# EAGLE design Lemming2_power (EAGLE 8.0.0)
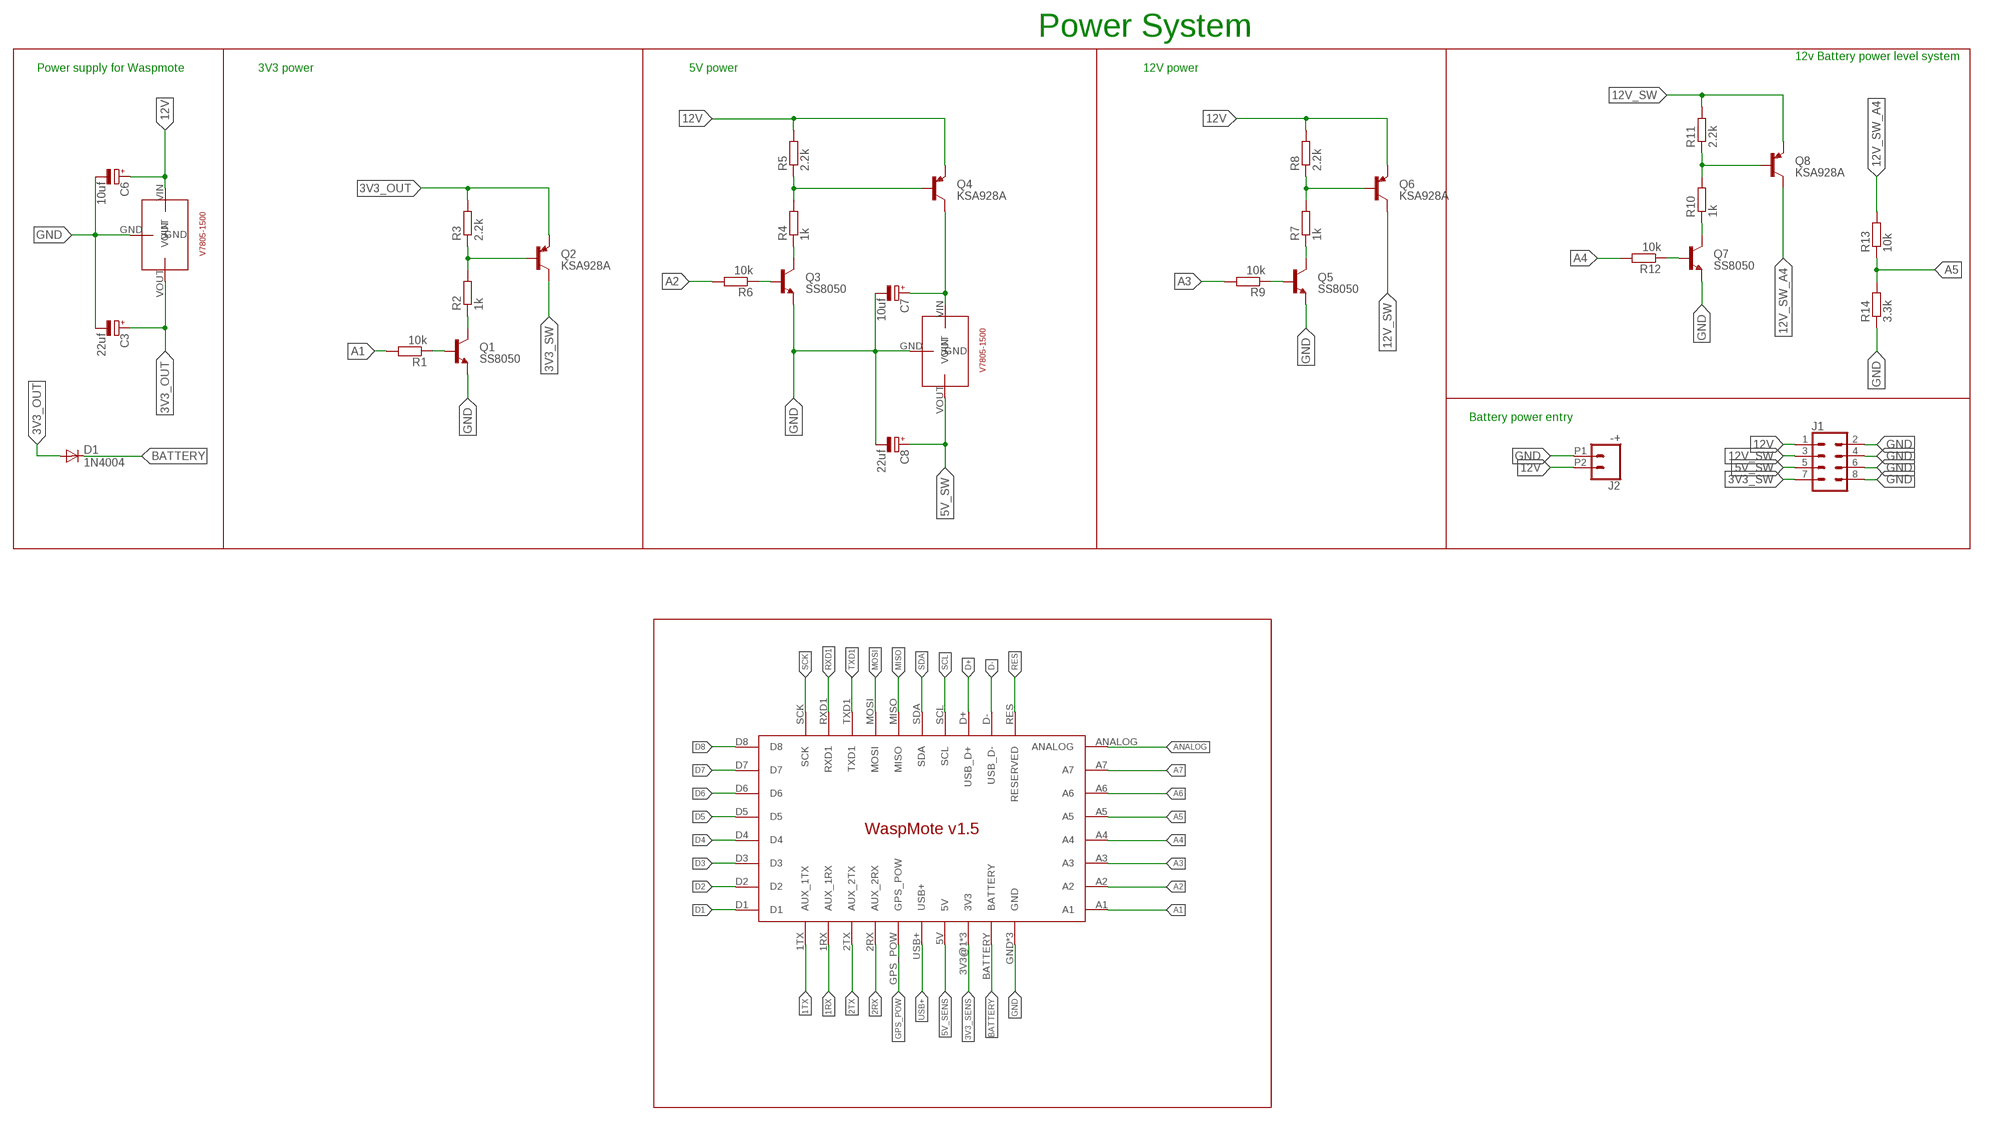
[diagram p0: schematic, sheet 1]

## Parts
C3  22uf  CPOL-EUE2.5-5  [E2,5-5]
C6  10uf  CPOL-EUE2.5-5  [E2,5-5]
C7  10uf  CPOL-EUE2.5-5  [E2,5-5]
C8  22uf  CPOL-EUE2.5-5  [E2,5-5]
D1  1N4004  [DO41-10]
J1  CONN_04X2  [2X4]
J2  -+  CONN_022.54MM_SCREWTERM  [1X02_2.54_SCREWTERM]
LM7805  V7805-1500  [V7805-1500]
Q1  SS8050  [TO-92-EBC]
Q2  KSA928A  [TO-92-ECB]
Q3  SS8050  [TO-92-EBC]
Q4  KSA928A  [TO-92-ECB]
Q5  SS8050  [TO-92-EBC]
Q6  KSA928A  [TO-92-ECB]
Q7  SS8050  [TO-92-EBC]
Q8  KSA928A  [TO-92-ECB]
R1  10k  RESISTOR_R-EU_0309/10  [RESISTOR_0309/10]
R2  1k  RESISTOR_R-EU_0309/10  [RESISTOR_0309/10]
R3  2.2k  RESISTOR_R-EU_0309/10  [RESISTOR_0309/10]
R4  1k  RESISTOR_R-EU_0309/10  [RESISTOR_0309/10]
R5  2.2k  RESISTOR_R-EU_0309/10  [RESISTOR_0309/10]
R6  10k  RESISTOR_R-EU_0309/10  [RESISTOR_0309/10]
R7  1k  RESISTOR_R-EU_0309/10  [RESISTOR_0309/10]
R8  2.2k  RESISTOR_R-EU_0309/10  [RESISTOR_0309/10]
R9  10k  RESISTOR_R-EU_0309/10  [RESISTOR_0309/10]
R10  1k  RESISTOR_R-EU_0309/10  [RESISTOR_0309/10]
R11  2.2k  RESISTOR_R-EU_0309/10  [RESISTOR_0309/10]
R12  10k  RESISTOR_R-EU_0309/10  [RESISTOR_0309/10]
R13  10k  RESISTOR_R-EU_0309/10  [RESISTOR_0309/10]
R14  3.3k  RESISTOR_R-EU_0309/10  [RESISTOR_0309/10]
U$1  WASPMOTE_V1.5  [WASPMOTE_V1.5]
U$22  V7803-1500  V7805-1500  [V7805-1500]

## Nets
1RX: U$1.1RX(AUX_1RX)
1TX: U$1.1TX(AUX_1TX)
2RX: U$1.2RX(AUX_2RX)
2TX: U$1.2TX(AUX_2TX)
3V3_OUT: C3.+ D1.A Q2.E R3.2 U$22.VOUT
3V3_SENS: U$1.3V3@1(3V3) U$1.3V3@2(3V3) U$1.3V3@3(3V3)
3V3_SW: J1.7 Q2.C
5V_SENS: U$1.5V
5V_SW: C8.+ J1.5 LM7805.VOUT
12V: C6.+ J1.1 J2.P2 Q4.E Q6.E R5.2 R8.2 U$22.VIN
12V_SW: J1.3 Q6.C Q8.E R11.2
12V_SW_A4: Q8.C R13.2
A1: R1.2 U$1.A1
A2: R6.2 U$1.A2
A3: R9.2 U$1.A3
A4: R12.2 U$1.A4
A5: R13.1 R14.2 U$1.A5
A6: U$1.A6
A7: U$1.A7
ANALOG: U$1.ANALOG
BATTERY: D1.C U$1.BATTERY
D1: U$1.D1
D2: U$1.D2
D3: U$1.D3
D4: U$1.D4
D5: U$1.D5
D6: U$1.D6
D7: U$1.D7
D8: U$1.D8
D+: U$1.D+(USB_D+)
D-: U$1.D-(USB_D-)
GND: C3.- C6.- C7.- C8.- J1.2 J1.4 J1.6 J1.8 J2.P1 LM7805.GND Q1.E Q3.E Q5.E Q7.E R14.1 U$1.GND U$1.GND_2(GND) U$1.USB-(GND) U$22.GND
GPS_POW: U$1.GPS_POW
MISO: U$1.MISO
MOSI: U$1.MOSI
N$1: Q2.B R2.2 R3.1
N$2: Q1.C R2.1
N$3: Q1.B R1.1
N$4: Q6.B R7.2 R8.1
N$6: Q4.B R4.2 R5.1
N$7: Q5.C R7.1
N$8: Q5.B R9.1
N$9: Q3.C R4.1
N$10: Q3.B R6.1
N$11: Q8.B R10.2 R11.1
N$12: Q7.C R10.1
N$13: Q7.B R12.1
N$16: C7.+ LM7805.VIN Q4.C
RES: U$1.RES(RESERVED)
RXD1: U$1.RXD1
SCK: U$1.SCK
SCL: U$1.SCL
SDA: U$1.SDA
TXD1: U$1.TXD1
USB+: U$1.USB+

## Notes on the sheet
- Power System
- 12v Battery power level system
- Power supply for Waspmote | 3V3 power | 5V power | 12V power
- Battery power entry

## Library data of the parts
C3 C6-C8 = resistor:CPOL-EU: POLARIZED CAPACITOR, European symbol
D1 = diode:1N4004: DIODE general purpose rectifier, 1 A
J1 = SparkFun-Connectors:CONN_04X2: Multi connection point. Often used as Generic Header-pin footprint for 0.1 inch spaced/style header connections On any of the 0.1 inch spaced packages, you can populate with these: Break Away Headers - Straight <https://www.sparkfun.com/products/116> (PRT-00116) Break Away Male Headers - Right Angle <https://www.sparkfun.com/products/553> (PRT-00553) Female Headers <https://www.sparkfun.com/products/115> (PRT-00115) Break Away Headers - Machine Pin <https://www.sparkfun.com/products/117> (PRT-00117) Break Away Female Headers - Swiss Machine Pin <https://www.sparkfun.com/products/743> (PRT-00743)
J2 = SparkFun-Retired:CONN_02: Multi connection point. Often used as Generic Header-pin footprint for 0.1 inch spaced/style header connections On any of the 0.1 inch spaced packages, you can populate with these: Break Away Headers - Straight <https://www.sparkfun.com/products/116> (PRT-00116) Break Away Male Headers - Right Angle <https://www.sparkfun.com/products/553> (PRT-00553) Female Headers <https://www.sparkfun.com/products/115> (PRT-00115) Break Away Headers - Machine Pin <https://www.sparkfun.com/products/117> (PRT-00117) Break Away Female Headers - Swiss Machine Pin <https://www.sparkfun.com/products/743> (PRT-00743) For SCREWTERMINALS and SPRING TERMINALS visit here: Screw Terimnals on SparkFun.com <https://www.sparkfun.com/search/results?term=Screw+Terminals> (5mm/3.5mm/2.54mm spacing) This device is also useful as a general connection point to wire up your design to another part of your project. Our various solder wires solder well into these plated through hole pads. Hook-Up Wire - Assortment (Stranded, 22 AWG) <https://www.sparkfun.com/products/11375> (PRT-11375) Hook-Up Wire - Assortment (Solid Core, 22 AWG) <https://www.sparkfun.com/products/11367> (PRT-11367) View the entire wire category on our website here <https://www.sparkfun.com/categories/141> Special notes: Molex polarized connector foot print use with: PRT-08233 with associated crimp pins and housings. 2.54_SCREWTERM for use with PRT-10571. 3.5mm Screw Terminal footprints for PRT-08084 5mm Screw Terminal footprints for use with PRT-08432
LM7805 U$22 = UIO_simon:V7805-1500: DC-DC converter 12V to 5V http://www.cui.com/product/resource/v78xx-1500.pdf
Q1 Q3 Q5 Q7 = UIO-John:SS8050
Q2 Q4 Q6 Q8 = UIO-John:KSA928A
R1-R14 = Lemming2_sensors:RESISTOR_R-EU_: RESISTOR, European symbol
U$1 = UIO-John:WASPMOTE_V1.5: WaspMote v1.5 (c) 2017 john.hulth@geo.uio.no

## Board
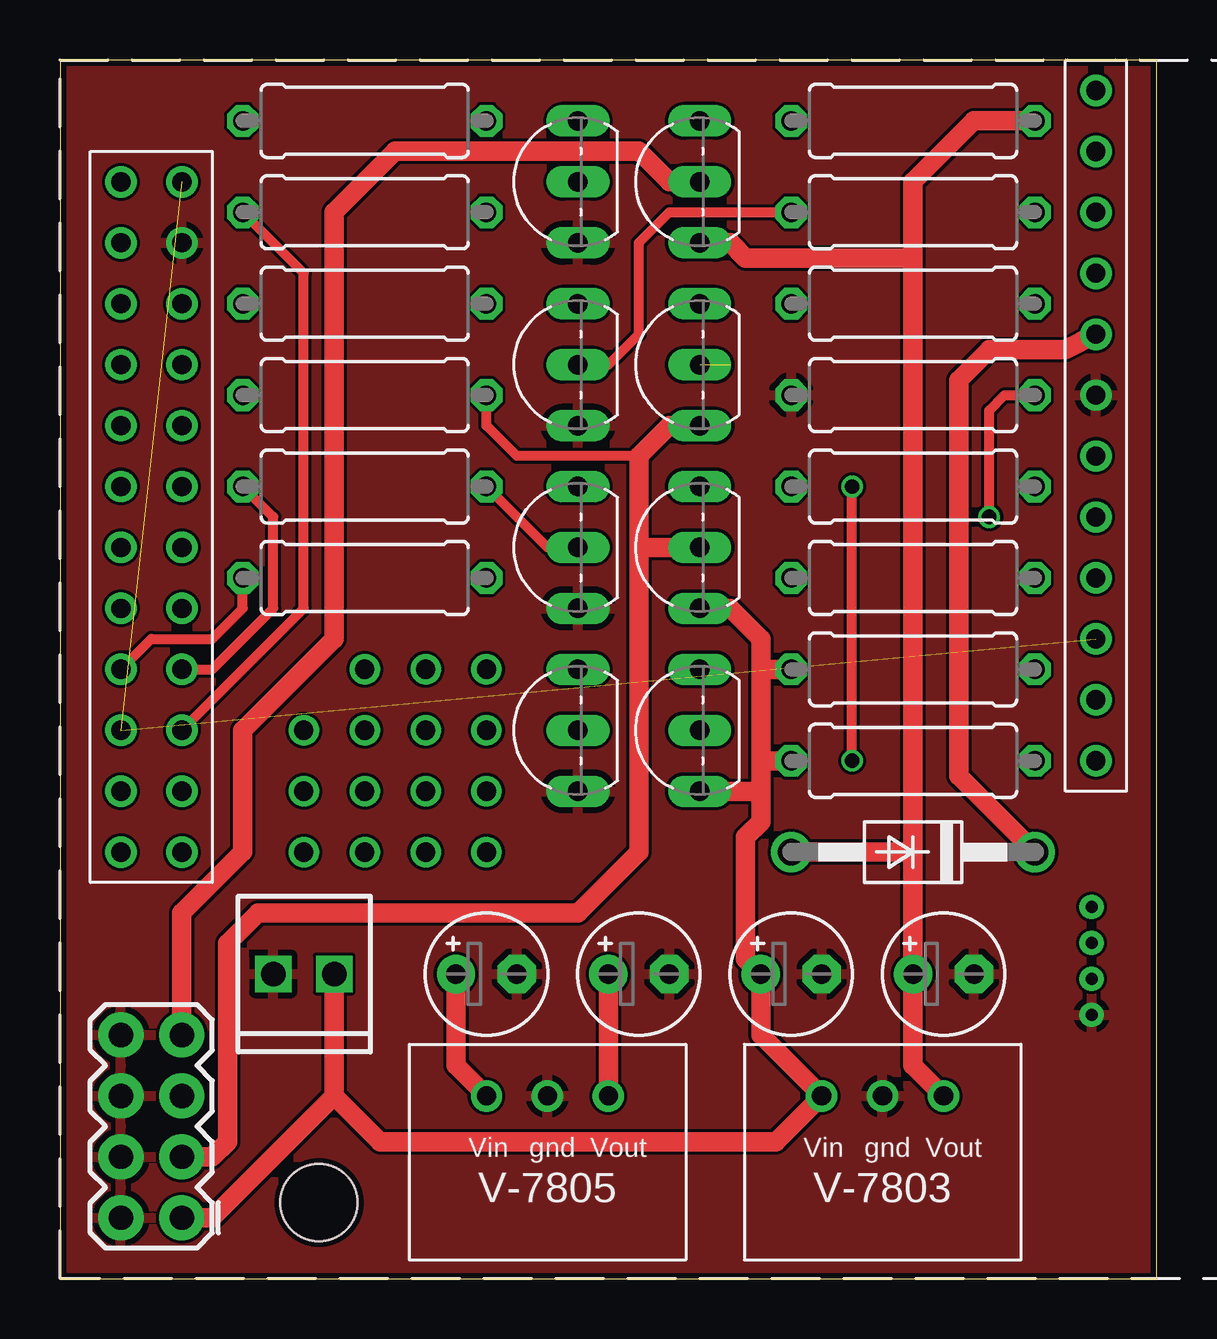
[diagram p1: board, top side]
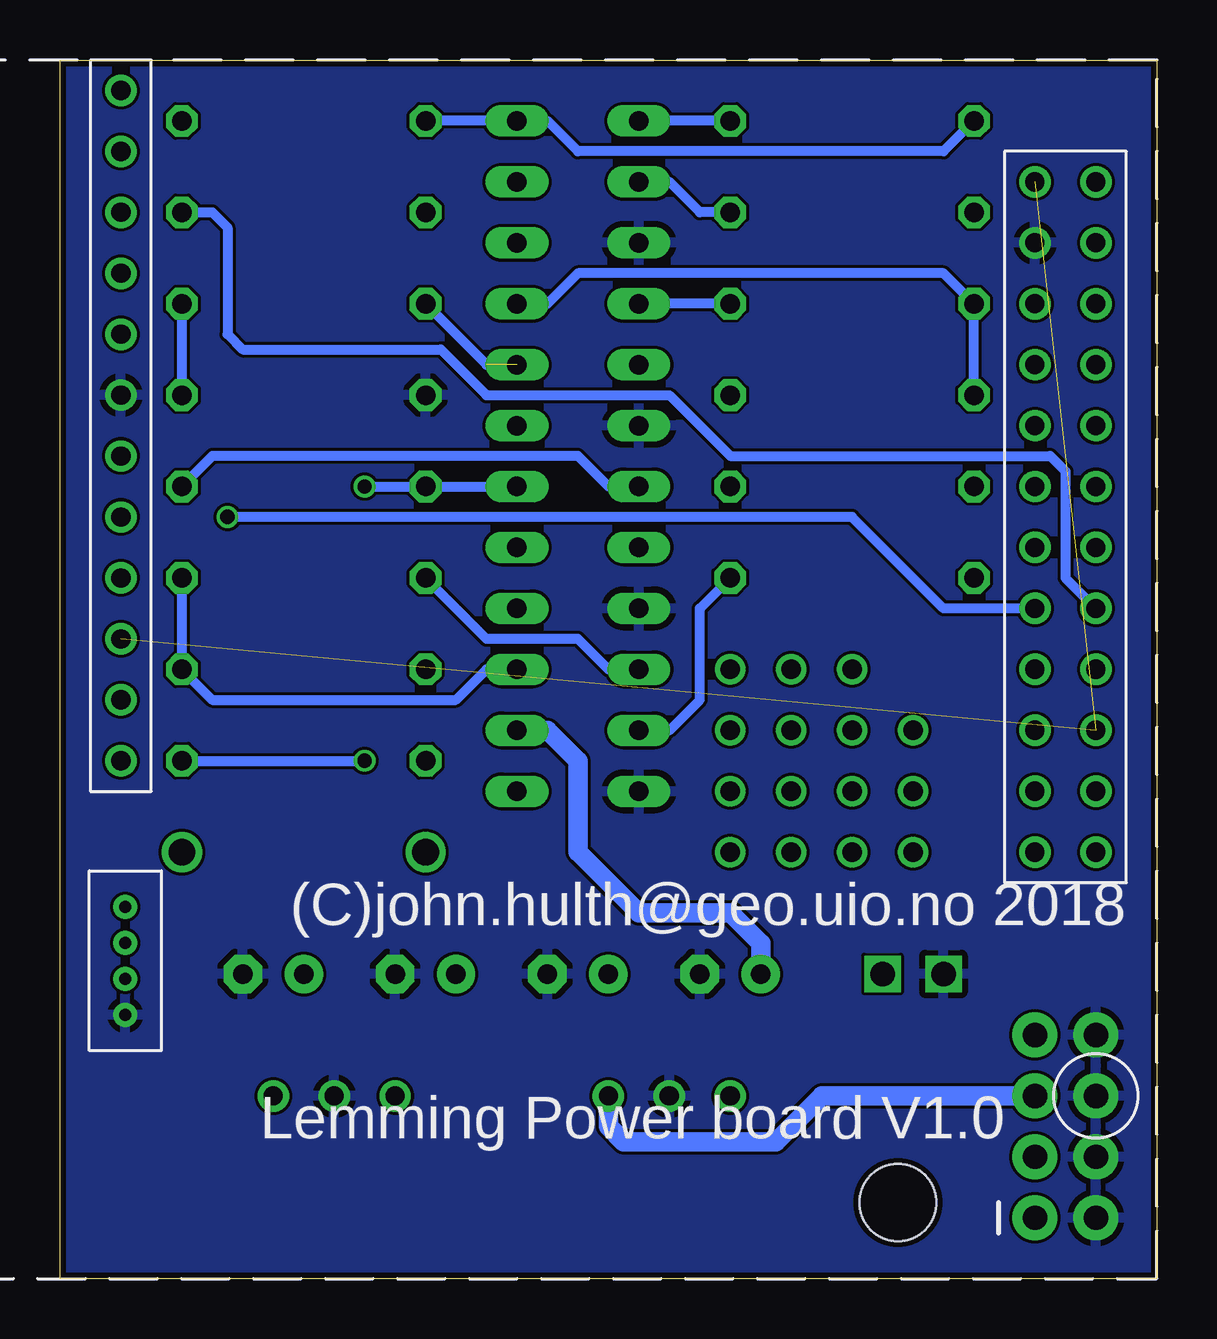
[diagram p2: board, bottom side, seen from below]

Size 45.72 x 50.8 mm. Coordinates in mm from the lower left corner, seen from the top.
Outline: 0,0 45.72,0 45.72,50.8 0,50.8 0,0
Copper layers (1*16): Top 0.035mm / dielectric 1.5mm / Bottom 0.035mm
Design rules "dirt_cheap_dirty_boards.v1": minimum track width 5mil, minimum drill 12mil, track to track 5mil, track to pad 5mil, pad to pad 5mil, via to via 5mil, smd to smd 0mil, copper to edge 10mil, drill to drill 10mil, minimum pad ring 10mil, minimum via ring 6mil, stop-mask expansion 2mil, vias tented up to drill 25mil, thermal gap 10mil
Holes 3.2 mm at 10.79,3.17

### Footprints (pad centres in the part's own frame; a part is rotated, then mirrored left to right if it is on the bottom)
E2,5-5 = drill 0.813 pad 1.6: + -1.27,0 | drill 0.813 pad 1.6 octagon: - 1.27,0
DO41-10 = drill 1.118: A 5.08,0; C -5.08,0
2X4 = drill 1.016 pad 1.88: 1 -3.81,-1.27; 2 -3.81,1.27; 3 -1.27,-1.27; 4 -1.27,1.27; 5 1.27,-1.27; 6 1.27,1.27; 7 3.81,-1.27; 8 3.81,1.27
1X02_2.54_SCREWTERM = drill 1.016 square: P1 2.54,0; P2 0,0
V7805-1500 = drill 0.8: GND 0,0; VIN -2.54,0; VOUT 2.54,0
TO-92-EBC = drill 0.813 long: B 0,0; C 2.54,0; E -2.54,0
TO-92-ECB = drill 0.813 long: B 2.54,0; C 0,0; E -2.54,0
RESISTOR_0309/10 = drill 0.813 octagon: 1 -5.08,0; 2 5.08,0
WASPMOTE_V1.5 = drill 0.8: 1RX 43.18,46.99; 1TX 43.18,49.53; 2RX 43.18,44.45; 2TX 43.18,41.91; 3V3@1 5.08,45.72; 3V3@2 2.54,22.86; 3V3@3 43.18,26.67; 5V 5.08,20.32; A1 5.08,22.86; A2 2.54,25.4; A3 5.08,25.4; A4 2.54,27.94; A5 5.08,27.94; A6 2.54,30.48; A7 5.08,30.48; ANALOG 2.54,45.72; BATTERY 43.18,39.37; D1 5.08,33.02; D2 2.54,35.56; D3 5.08,35.56; D4 2.54,38.1; D5 5.08,38.1; D6 2.54,40.64; D7 5.08,40.64; D8 2.54,43.18; GND 5.08,43.18; GND_2 43.18,36.83; GPS_POW 2.54,20.32; MISO 43.18,21.59; MOSI 43.18,24.13; RES 2.54,33.02; RXD1 43.18,31.75; SCK 43.18,34.29; SCL 5.08,17.78; SDA 2.54,17.78; TXD1 43.18,29.21 | drill 0.5: D+ 43,12.5; D- 43,14; USB+ 43,15.5; USB- 43,11

### Placement (x,y rotation side)
C3  36.83,12.7 0 top
C6  30.48,12.7 0 top
C7  17.78,12.7 0 top
C8  24.13,12.7 0 top
D1  35.56,17.78 180 top
J1  3.81,6.35 90 top
J2  11.43,12.7 180 top
LM7805  20.32,7.62 0 top
Q1  21.59,45.72 90 top
Q2  26.67,45.72 90 top
Q3  21.59,22.86 90 top
Q4  26.67,22.86 90 top
Q5  21.59,30.48 90 top
Q6  26.67,30.48 90 top
Q7  21.59,38.1 90 top
Q8  26.67,38.1 90 top
R1  12.7,44.45 180 top
R2  12.7,48.26 180 top
R3  35.56,48.26 0 top
R4  35.56,29.21 0 top
R5  35.56,25.4 180 top
R6  12.7,29.21 180 top
R7  35.56,33.02 180 top
R8  35.56,21.59 180 top
R9  12.7,33.02 180 top
R10  12.7,40.64 180 top
R11  12.7,36.83 0 top
R12  35.56,44.45 0 top
R13  35.56,40.64 180 top
R14  35.56,36.83 0 top
U$1  0,0 0 top
U$22  34.29,7.62 0 top

### Tracks (layer width: path | path; a pad name or v marks a point on that pad's centre or on a via)
3V3_OUT
  Top 0.813: 35.56,17.78 C3.+ 35.56,8.89 U$22.VOUT | 35.56,17.78 D1.A | 35.56,17.78 35.56,42.55 | 35.56,42.55 28.57,42.55 27.94,43.18 Q2.E | 35.56,42.55 35.56,45.72 38.1,48.26 R3.2
3V3_SENS  (2 unrouted)
3V3_SW
  Top 0.813: J1.7 5.08,15.24 7.62,17.78 7.62,22.86 11.43,26.67 11.43,44.45 13.97,46.99 24.13,46.99 25.4,45.72 Q2.C
5V_SW
  Top 0.813: LM7805.VOUT C8.+
  Bottom 0.813: LM7805.VOUT 22.86,6.35 22.23,5.71 15.88,5.71 13.97,7.62 J1.5
12V
  Top 0.813: J1.1 6.35,2.54 11.43,7.62 | 29.21,21.59 29.21,20.32 | 29.21,25.4 29.21,21.59 | 29.21,25.4 29.21,26.67 27.94,27.94 Q6.E | Q4.E 29.21,20.32 | R8.2 29.21,21.59 | R5.2 29.21,25.4 | 11.43,7.62 J2.P2 | 11.43,7.62 13.34,5.71 29.84,5.71 U$22.VIN 29.21,10.16 C6.+ 28.57,13.34 28.57,18.41 29.21,19.05 29.21,20.32
12V_SW
  Top 0.406: 24.13,34.29 19.05,34.29 17.78,35.56 R11.2
  Top 0.813: 24.13,30.48 24.13,34.29 25.4,35.56 Q8.E | 24.13,30.48 24.13,17.78 21.59,15.24 8.26,15.24 6.99,13.97 6.99,5.71 6.35,5.08 J1.3 | Q6.C 24.13,30.48
12V_SW_A4  (1 unrouted)
  Bottom 0.406: 27.94,38.1 R13.2
A1
  Top 0.406: U$1.A1 10.16,27.94 10.16,41.91 R1.2
A2
  Top 0.406: U$1.A2 3.81,26.67 6.35,26.67 7.62,27.94 R6.2
A3
  Top 0.406: U$1.A3 6.35,25.4 8.89,27.94 8.89,31.75 R9.2
A4
  Bottom 0.406: R12.2 39.37,44.45 38.73,43.81 38.73,39.37 38.1,38.73 29.84,38.73 27.94,36.83 20.32,36.83 17.78,34.29 4.45,34.29 3.81,33.66 3.81,29.21 U$1.A4
A5  (via drill 0.6)
  Top 0.406: v38.73,31.75 38.73,36.2 39.37,36.83 R14.2
  Bottom 0.406: R13.1 R14.2 | v38.73,31.75 12.7,31.75 8.89,27.94 U$1.A5
BATTERY
  Top 0.813: U$1.BATTERY 41.91,38.73 38.73,38.73 37.47,37.47 37.47,20.95 D1.C
GND
  pour Bottom: 0,50.8 45.72,50.8 45.72,0 0,0
  pour Top: 0,50.8 45.72,50.8 45.72,0 0,0
N$1
  Bottom 0.406: R2.2 8.89,46.99 24.13,46.99 25.4,48.26 Q2.B R3.1
N$2
  Bottom 0.406: R2.1 Q1.C
N$3
  Bottom 0.406: R1.1 19.05,44.45 20.32,45.72 Q1.B
N$4  (via drill 0.6)
  Top 0.406: v33.02,21.59 v33.02,33.02
  Bottom 0.406: Q6.B R7.2 v33.02,33.02 | R8.1 v33.02,21.59
N$5  (via drill 0.8 pad 1.27)
  other vias: 10.16,17.78
N$6
  Bottom 0.406: R4.2 R5.1 39.37,24.13 29.21,24.13 27.94,25.4 Q4.B
N$7
  Bottom 0.406: Q5.C 22.86,33.02 24.13,34.29 39.37,34.29 R7.1
N$8
  Top 0.406: Q5.B 20.32,30.48 R9.1
N$9
  Bottom 0.406: Q3.C 22.86,25.4 24.13,26.67 27.94,26.67 R4.1
N$10
  Bottom 0.406: 20.32,22.86 Q3.B 20.32,22.86 | 20.32,22.86 19.05,24.13 19.05,27.94 R6.1
N$11
  Bottom 0.406: Q8.B 25.4,40.64 24.13,41.91 8.89,41.91 R10.2 R11.1
N$12
  Bottom 0.406: R10.1 Q7.C
N$13
  Top 0.406: Q7.B 22.86,38.1 24.13,39.37 24.13,43.18 25.4,44.45 R12.1
N$14  (via drill 0.8 pad 1.27)
  other vias: 12.7,17.78
N$15  (via drill 0.8 pad 1.27)
  other vias: 15.24,17.78
N$16
  Top 0.813: LM7805.VIN 16.51,8.89 C7.+
  Bottom 0.813: Q4.C 25.4,22.86 24.13,21.59 24.13,17.78 21.59,15.24 17.78,15.24 16.51,13.97 C7.+
N$17  (via drill 0.8 pad 1.27)
  other vias: 17.78,17.78
N$18  (via drill 0.8 pad 1.27)
  other vias: 15.24,25.4
N$19  (via drill 0.8 pad 1.27)
  other vias: 12.7,25.4
N$20  (via drill 0.8 pad 1.27)
  other vias: 17.78,20.32
N$21  (via drill 0.8 pad 1.27)
  other vias: 15.24,20.32
N$22  (via drill 0.8 pad 1.27)
  other vias: 12.7,20.32
N$23  (via drill 0.8 pad 1.27)
  other vias: 10.16,20.32
N$24  (via drill 0.8 pad 1.27)
  other vias: 10.16,22.86
N$25  (via drill 0.8 pad 1.27)
  other vias: 12.7,22.86
N$26  (via drill 0.8 pad 1.27)
  other vias: 15.24,22.86
N$27  (via drill 0.8 pad 1.27)
  other vias: 17.78,22.86
N$28  (via drill 0.8 pad 1.27)
  other vias: 17.78,25.4

### Text on the board
tNames: V-7805 | V-7803
bNames: (C)john.hulth@geo.uio.no 2018 | Lemming Power board V1.0